# Altium schematic sheet 3V3_Buck.SchDoc
size A; SheetNumber: 1; SheetTotal: 15; SPICEModelCacheKMHHWGDA: <root> / <DocumentId>KMHHWGDA</DocumentId> / <CacheFrame Number="0"> / <Model Name="lm317" Kind="CKT"> / <Text>*------------------------------------------------- / * POSITIVE ADJUSTABLE VOLTAGE REGULATOR / .SUBCKT LM317 IN ADJ OUT / JADJ IN ADJ ADJ JADJMOD / VREF 4 ADJ 1.250 / DBK IN 13 DMOD / CBC 13 15 800.0E-12 / RBC 15 5 1.000E3 / QPASS 13 5 OUT QPASSMOD / RB1 7 6 1 / RB2 6 5 128.3 / DSC 6 11 DMOD / ESC 11 OUT VALUE={5.646-.6667*V(6,5)*V(13,5)} / DFB 6 12 DMOD / EFB 12 OUT VALUE={8.822-.4024*V(13,5)+5.250E-3*V(13,5)*V(13,5) -.6667*V(13,5)*V(6,5)} / EB 7 OUT 8 OUT 6.939 / RP 9 8 100 / CPZ 10 OUT 3.183E-6 / DPU 10 OUT DMOD / RZ 8 10 .1 / EP 9 OUT 4 OUT 100 / RI OUT 4 100MEG / .MODEL QPASSMOD NPN (IS=30F BF=50 VAF=1.500 NF=1.701) / .MODEL JADJMOD NJF (BETA=50.00E-6 VTO=-1) / .MODEL DMOD D (IS=30F N=1.701) / .ENDS</Text> / </Model> / </CacheFrame> / </root>
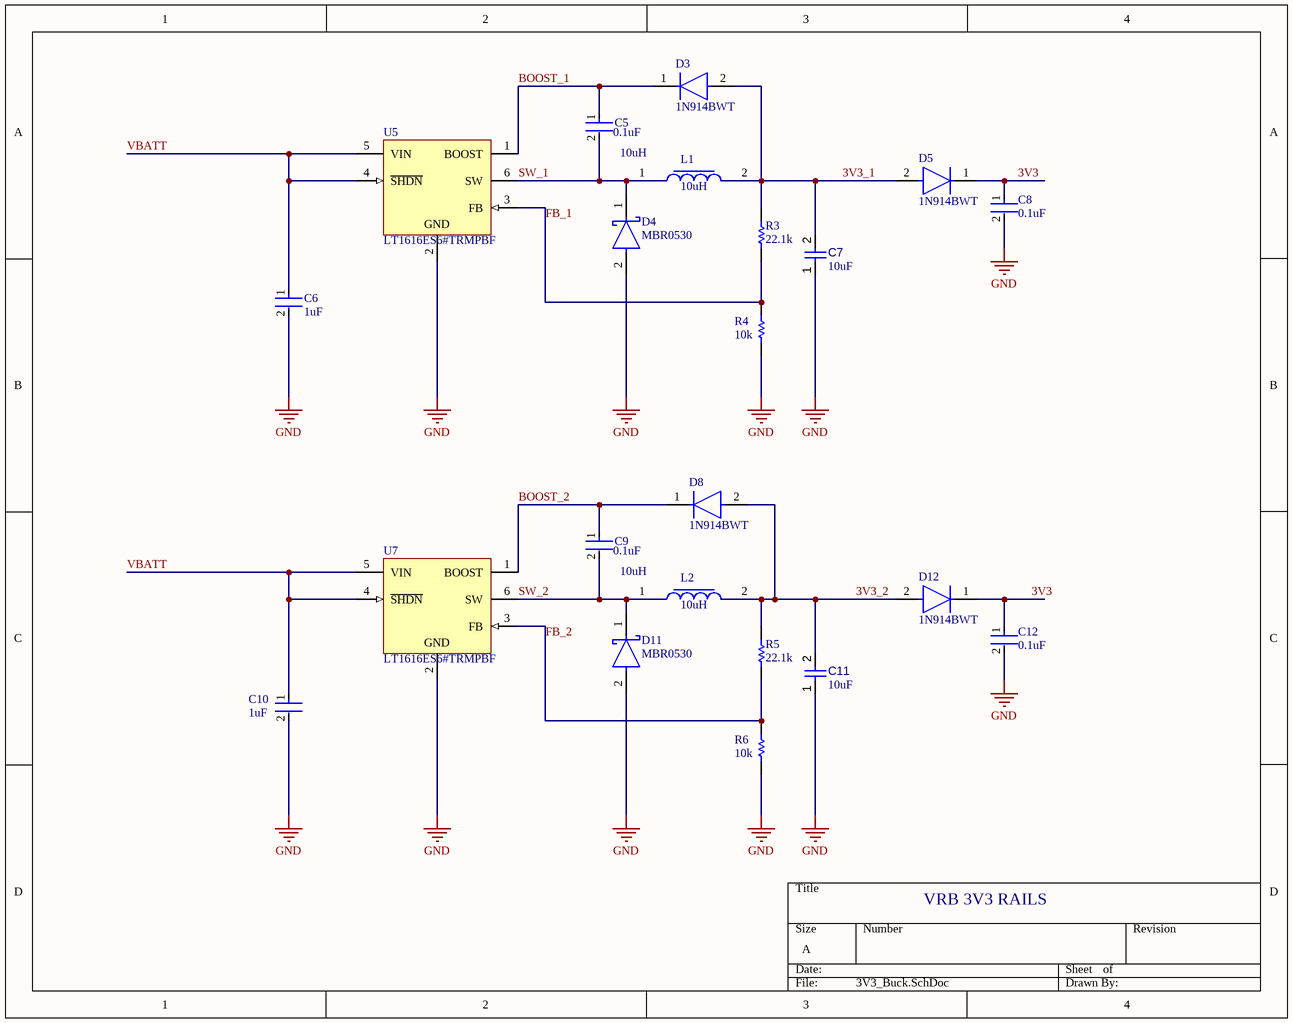
[diagram p0: 3V3_Buck.SchDoc]

## Parts
C5  0.1uF  [FP-C0603-CJ-MFG]
C6  1uF  [FP-CL10-IPC_B]
C7  value 10uF  [CAPC0603(1608)100_L]  (hidden comment: Capacitor 10µF +/-20% 10V 0603)
C8  0.1uF  [FP-C0603-CJ-MFG]
C9  0.1uF  [FP-C0603-CJ-MFG]
C10  1uF  [FP-CL10-IPC_B]
C11  value 10uF  [CAPC0603(1608)100_L]  (hidden comment: Capacitor 10µF +/-20% 10V 0603)
C12  0.1uF  [FP-C0603-CJ-MFG]
D3  1N914BWT  [FP-502-01-MFG]
D4  MBR0530  [FP-425-04-MFG]
D5  1N914BWT  [FP-502-01-MFG]
D8  1N914BWT  [FP-502-01-MFG]
D11  MBR0530  [FP-425-04-MFG]
D12  1N914BWT  [FP-502-01-MFG]
L1  Inductance: 10uH  [INDM3532X15N]  (hidden comment: PA4547.103NLT)
L2  Inductance: 10uH  [INDM3532X15N]  (hidden comment: PA4547.103NLT)
R3  22.1k  [RESC1609X50X30LL10T20]
R4  10k  [RESC1609X50X30NL8T20]
R5  22.1k  [RESC1609X50X30LL10T20]
R6  10k  [RESC1609X50X30NL8T20]
U5  LT1616ES6#TRMPBF  [LT-S6-6-SOT-23_M]
U7  LT1616ES6#TRMPBF  [LT-S6-6-SOT-23_M]

## Nets
GND: C6.2 C7.1 C8.2 C10.2 C11.1 C12.2 D4.2(A) D11.2(A) R4.1 R6.1 U5.2(GND) U7.2(GND)
3V3: C8.1 C12.1 D5.1(C) D12.1(C)
3V3_1: C7.2 D3.2(A) D5.2(A) L1.2 R3.2
3V3_2: C11.2 D8.2(A) D12.2(A) L2.2 R5.2
BOOST_1: C5.1 D3.1(C) U5.1(BOOST)
BOOST_2: C9.1 D8.1(C) U7.1(BOOST)
FB_1: R3.1 R4.2 U5.3(FB)
FB_2: R5.1 R6.2 U7.3(FB)
SW_1: C5.2 D4.1(C) L1.1 U5.6(SW)
SW_2: C9.2 D11.1(C) L2.1 U7.6(SW)
VBATT: C6.1 C10.1 U5.4(~{SHDN}) U5.5(VIN) U7.4(~{SHDN}) U7.5(VIN)

## Notes on the sheet
- (near L1) 10uH
- (near L2) 10uH
- VRB 3V3 RAILS

## Library data of the parts
C5 C8 C9 C12 = CMP-2006-03300-2: CAP CER 0.1UF 50V X7R 0603 / C0603X104K5RACTU; Manufacturer: Kemet; Capacitance: 100nF; Material: Ceramic; Tolerance: 10%; Value: 100nF; Temperature Coefficient: 15%; Temperature Range High: +125°C; Temperature Range Low: -55°C; Manufacturer Part Number: C0603X104K5RACTU; Voltage: 50V; ComponentLink2Description: Datasheet; RoHS: TRUE; ComponentLink2URL: https://content.kemet.com/datasheets/KEM_C1013_X7R_FT-CAP_SMD.pdf; Device Class L3: Ceramic Capacitors; Device Class L2: Capacitors; Package: C0603-CJ; Height: 0.95mm; Device Class L1: Passive Components; Temperature Characteristic: X7R; Lead Free: Yes; Digikey Description: CAP CER 0.1UF 50V X7R 0603; Automotive: No; Mouser Description: Capacitor; Ceramic; Cap 0.1uF; Tol+10%; SMT; Flexible Termination; Vol-Rtg 50V; TR; Temperature: -55°C to +125°C; Octopart: https://octopart.com/c0603x104k5ractu-kemet-9145062; Category: Cap; Voltage Rating: 50V; Ipc Land Pattern Name: CAPC16080X80
C6 C10 = CMP-13271-001107-1: Cap Ceramic 1uF 25V X7R ±10% Pad SMD 0603 +125°C T/R; Width: 0.031inch; Voltage Rating: 25V; Length: 0.063inch; Min Operating Temperature: -55°C; Package Quantity: 1; Tolerance: 10%; Case Code (Metric): 1608; Case/Package: 0603; Mount: Surface Mount; Thickness: 0.035inch; Lead Free: Lead Free; Case Code (Imperial): 0603; Capacitance: 1uF; Depth: 0.8mm; Dielectric: X7R; Max Operating Temperature: 125°C; Radiation Hardening: No; Packaging: Tape and Reel; Height: 0.8mm
C7 C11 = CMP-001-00075-4: Chip Capacitor, 10µF +/-20%, 10V, 0603, Thickness 1 mm; Tolerance: 10%; Voltage Rating: 10V; Max Operating Temperature: 85°C; Pins: 2; Case/Package: 0603; Mounting Technology: SMT; Min Operating Temperature: -55°C
D3 D5 D8 D12 = CMP-07163-000008-1: DIODE GEN PURP 75V 200MA SOD523F; Manufacturer: ON Semiconductor; Forward Current: 300mA; Capacitance: 4pF; Max Junction Temp: +150°C; Reverse Voltage: 100V; Value: 4pF; Peak Reverse Current: 5uA; ComponentLink2Description: Datasheet; Package: 502-01; Manufacturer Part Number: 1N914BWT; Digikey Description: DIODE GEN PURP 75V 200MA SOD523F; Temperature Range High: +150°C; Temperature: -55°C to +150°C; Footprint Url: https://www.onsemi.com/pub/Collateral/502-01.PDF; Device Class L2: Diodes; Lead Free: Yes; Automotive: No; Category: Diode; Octopart: https://octopart.com/1n914bwt-on+semiconductor-84323166; Device Class L1: Discrete Semiconductors; Ipc Land Pattern Name: SODFL16080X60; Device Class L3: Rectifier Diodes; Height: 0.7mm; Max Repetitive Reverse Voltage: 75V; Mouser Description: Diodes - General Purpose, Power, Switching SINGLE JUNC. 100V 4.0NS COMP; Temperature Range Low: -55°C; ComponentLink2URL: https://www.onsemi.com/pub/Collateral/1N914BWT-D.pdf; RoHS: TRUE
D4 D11 = CMP-2000-05113-2: DIODE SCHOTTKY 30V 500MA SOD123; Polarity: Standard; Max Reverse Leakage Current: 130uA; Forward Voltage: 430mV; Element Configuration: Single; Peak Non-Repetitive Surge Current: 5.5A; REACH SVHC: No SVHC; Contact Plating: Tin; Width: 1.6mm; Weight: 0.03g; Max Reverse Voltage (DC): 30V; Mount: Surface Mount; Max Repetitive Reverse Voltage (Vrrm): 30V; Number of Pins: 2; Height: 1.03mm; Current Rating: 500mA; Max Forward Surge Current (Ifsm): 5.5A; Lead Free: Lead Free; Max Surge Current: 5.5A; Peak Reverse Current: 130uA; Min Operating Temperature: -65°C; Radiation Hardening: No; Max Operating Temperature: 150°C; Average Rectified Current: 500mA; Packaging: Tape and Reel; Length: 2.7mm; Forward Current: 500mA; Voltage Rating (DC): 30V; Package Quantity: 1; Output Current: 500mA; Part Number: *
L1 L2 = CMP-006-00022-2: Inductor Power Molded Wirewound 10uH 20% 100KHz 1.2A 0.522Ohm DCR Automotive T/R; DC Resistance MAX: 522 mOhms; Rated Current: 1.20A; Saturation Current: 1.6A; DC Resistance Typical: 435 mOhms
R3 R5 = CMP-2000-03094-1: Part Number: CRCW060322K1FKEA; Manufacturer: Vishay Dale
R4 R6 = CMP-1666-00005-4: Chip Resistor, 10 KOhm, +/- 1%, 100 mW, -55 to 155 degC, 0603 (1608 Metric), RoHS, Tape and Reel / CRCW060310K0FKEA; Manufacturer: Vishay Semiconductor; Voltage Rating: 75 V; Value: 1K; Max Operating Temperature: 155 degC; PackageDescription: 2-Pin Surface Mount Device, Body 1.575 x 0.85 mm; ComponentLink1Description: Manufacturer URL; RoHSCompliant: true; PackageReference: 0603; REACH SVHC: Unknown; Length: 1.55 mm; DatasheetVersion: 06/2012; Packaging: Tape and Reel; Min Operating Temperature: -55 degC; Mounting Technology: Surface Mount; ComponentLink2URL: https://datasheet.ciiva.com/11809/0900766b80d98afc-11809037.pdf; Height: 0.45 mm; ComponentLink2Description: Datasheet; Package Quantity: 5000; ComponentLink1URL: http://www.vishay.com/
U5 U7 = CMP-0491-01627-1: 600 mA, 1.4 MHz Step-Down Switching Regulator, 6-pin SOT23 (S6-6), -40 to 85 degC, Pb-Free, Mini Tape and Reel; Manufacturer: Linear Technology; Number of Outputs: 1; PackageDescription: 6-Pin Plastic SOT-23, Body 1.625 x 2.9 mm, Pitch 0.95 mm; ComponentLink1Description: Manufacturer URL; Mounting Technology: Surface Mount; PackageVersion: Aug-07; ComponentLink3Description: Package Specification; PackageReference: S6-6; RoHS: TRUE; ComponentLink1URL: http://www.linear.com/; ComponentLink2Description: Datasheet; Packing: Mini Tape and Reel; PartNumber: LT1616ES6#TRMPBF; ComponentLink2URL: http://cds.linear.com/docs/en/datasheet/lt1616fs.pdf; ComponentLink3URL: http://cds.linear.com/docs/en/datasheet/175435f.pdf